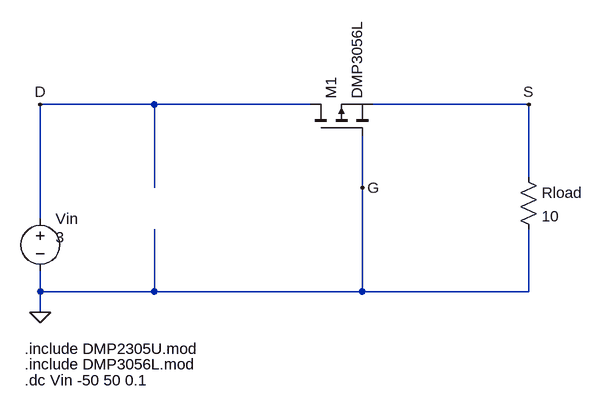
[diagram p0: schematic reverse-polarity2.asc]
reverse-polarity2.asc, the LTspice schematic file:
Version 4
SHEET 1 2056 680
WIRE 320 -208 144 -208
WIRE 560 -208 320 -208
WIRE 896 -208 656 -208
WIRE 896 -96 896 -208
WIRE 320 -80 320 -208
WIRE 640 -80 640 -160
WIRE 144 -32 144 -208
WIRE 144 80 144 48
WIRE 320 80 320 -16
WIRE 320 80 144 80
WIRE 640 80 640 -80
WIRE 640 80 320 80
WIRE 896 80 896 -16
WIRE 896 80 640 80
WIRE 144 112 144 80
FLAG 144 112 0
FLAG 144 -208 D
FLAG 896 -208 S
FLAG 640 -80 G
SYMBOL pmos 560 -160 R270
SYMATTR InstName M1
SYMATTR Value DMP3056L
SYMATTR Prefix X
SYMBOL voltage 144 -48 R0
WINDOW 3 24 44 Left 2
WINDOW 123 0 0 Left 2
WINDOW 39 0 0 Left 2
SYMATTR Value 3
SYMATTR InstName Vin
SYMBOL res 880 -112 R0
SYMATTR InstName Rload
SYMATTR Value 10
TEXT 120 192 Left 2 !.include DMP3056L.mod
TEXT 120 216 Left 2 !.dc Vin -50 50 0.1
TEXT 120 168 Left 2 !.include DMP2305U.mod

The netlist it stands for:
* reverse-polarity2.asc
XM1 D 0 S DMP3056L  ; pins D G S
Vin D 0 3
Rload S 0 10
.include DMP3056L.mod
.dc Vin -50 50 0.1
.include DMP2305U.mod
.backanno
.end